# EAGLE design main_pcb (EAGLE 7.5.0)
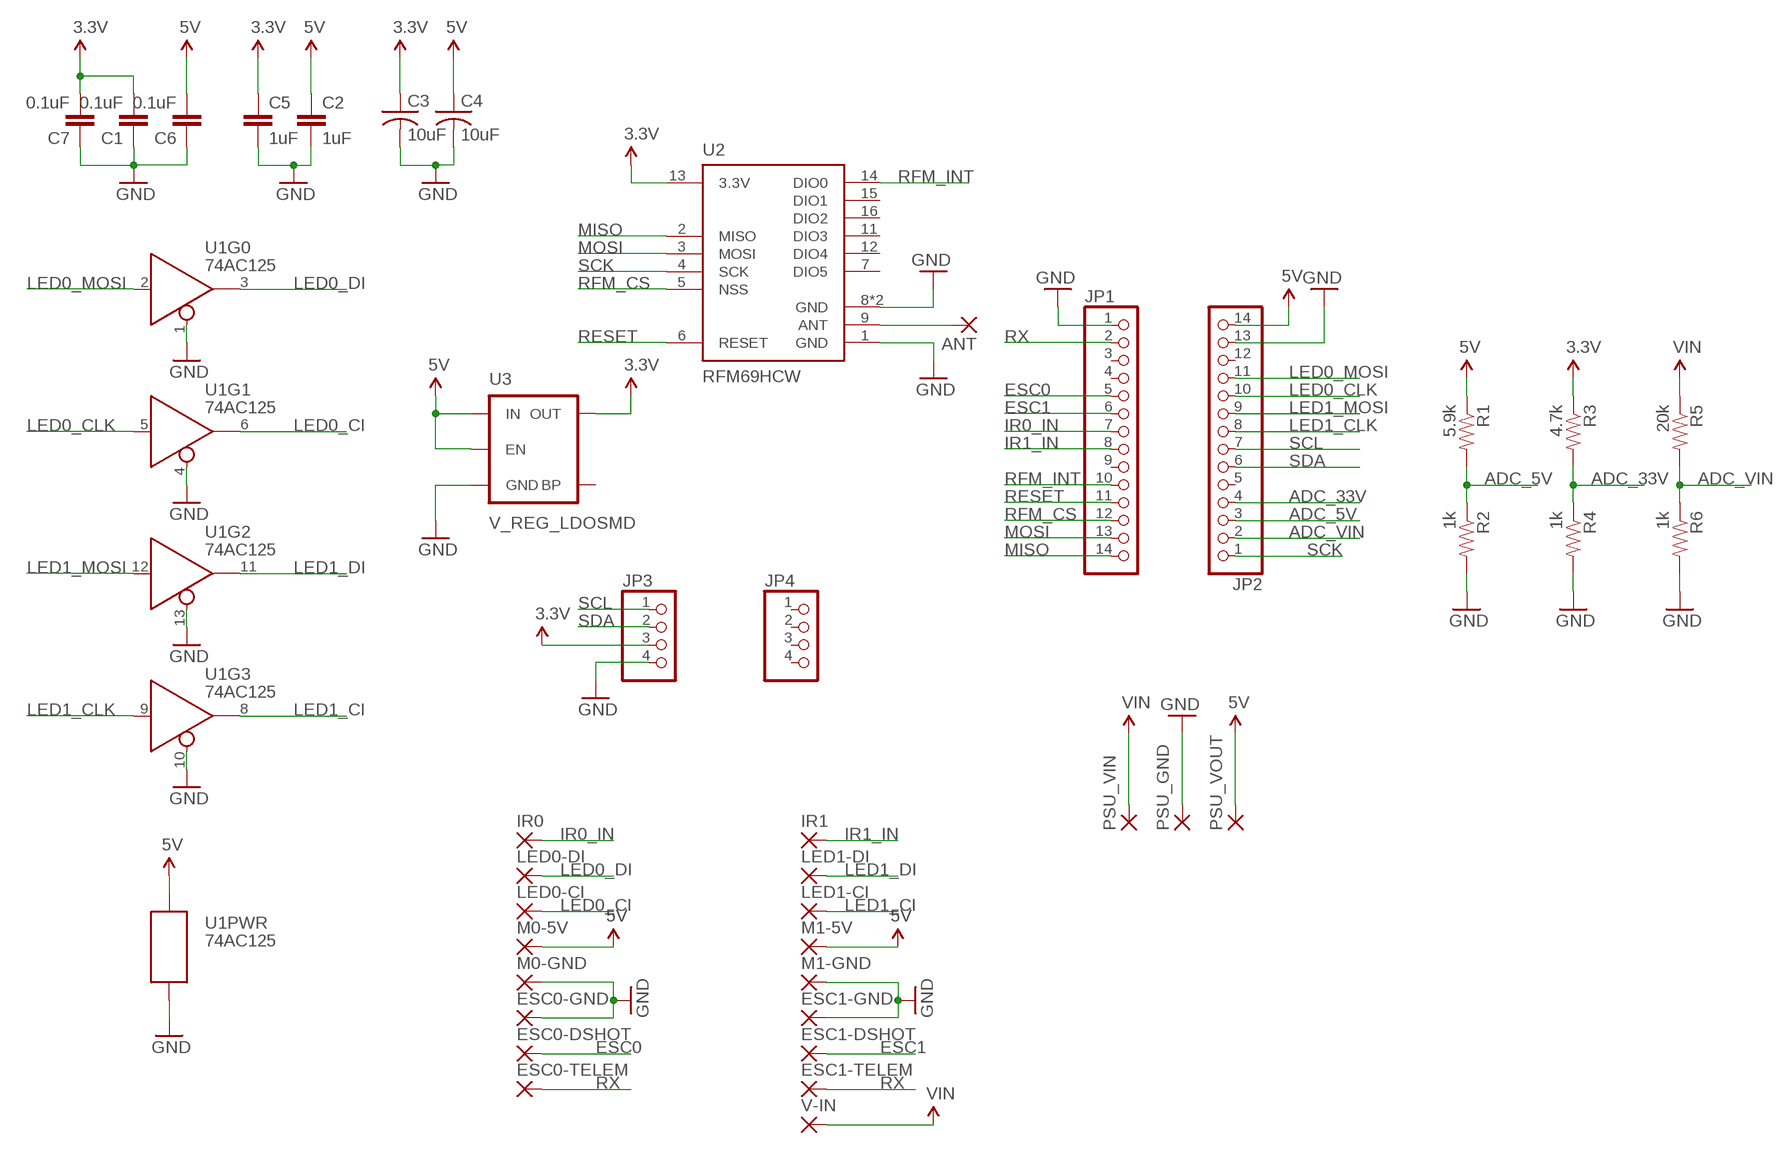
[diagram p0: schematic, sheet 1]

## Parts
ANT  WIREPADSMD5-1,8  [5-1,8]
C1  0.1uF  CAP0805  [0805]
C2  1uF  CAP0805  [0805]
C3  10uF  C-USC1206  [C1206]
C4  10uF  C-USC1206  [C1206]
C5  1uF  CAP0805  [0805]
C6  0.1uF  CAP0805  [0805]
C7  0.1uF  CAP0805  [0805]
ESC0-DSHOT  WIREPADSMD5-1,8  [5-1,8]
ESC0-GND  WIREPADSMD5-1,8  [5-1,8]
ESC0-TELEM  WIREPADSMD5-1,8  [5-1,8]
ESC1-DSHOT  WIREPADSMD5-1,8  [5-1,8]
ESC1-GND  WIREPADSMD5-1,8  [5-1,8]
ESC1-TELEM  WIREPADSMD5-1,8  [5-1,8]
IR0  WIREPADSMD5-1,8  [5-1,8]
IR1  WIREPADSMD5-1,8  [5-1,8]
JP1  PINHD-1X141X14_SMT  [1X14_SMT]
JP2  PINHD-1X141X14_SMT  [1X14_SMT]
JP3  PINHD-1X41X04_SMT  [1X04_SMT]
JP4  PINHD-1X41X04_SMT  [1X04_SMT]
LED0-CI  WIREPADSMD5-1,8  [5-1,8]
LED0-DI  WIREPADSMD5-1,8  [5-1,8]
LED1-CI  WIREPADSMD5-1,8  [5-1,8]
LED1-DI  WIREPADSMD5-1,8  [5-1,8]
M0-5V  WIREPADSMD5-1,8  [5-1,8]
M0-GND  WIREPADSMD5-1,8  [5-1,8]
M1-5V  WIREPADSMD5-1,8  [5-1,8]
M1-GND  WIREPADSMD5-1,8  [5-1,8]
PSU_GND  WIREPADSMD5-1,8  [5-1,8]
PSU_VIN  WIREPADSMD5-1,8  [5-1,8]
PSU_VOUT  WIREPADSMD5-1,8  [5-1,8]
R1  5.9k  RESISTOR0805-RES  [0805]
R2  1k  RESISTOR0805-RES  [0805]
R3  4.7k  RESISTOR0805-RES  [0805]
R4  1k  RESISTOR0805-RES  [0805]
R5  20k  RESISTOR0805-RES  [0805]
R6  1k  RESISTOR0805-RES  [0805]
U1  74AC125  74AC125DG125  [SO14]
U2  RFM69HCW  [RFM69HCW-XXXS2]
U3  V_REG_LDOSMD  [SOT23-5]
V-IN  WIREPADSMD5-1,8  [5-1,8]

## Nets
3.3V: C1.2 C3.1 C5.1 C7.2 JP3.3 R3.1 U2.13(3.3V) U3.5(OUT)
5V: C2.1 C4.1 C6.2 JP2.14 M0-5V.1(P) M1-5V.1(P) PSU_VOUT.1(P) R1.1 U1.14(PWR:P$V+) U3.1(IN) U3.3(EN)
ADC_5V: JP2.3 R1.2 R2.1
ADC_33V: JP2.4 R3.2 R4.1
ADC_VIN: JP2.2 R5.2 R6.1
ESC0: ESC0-DSHOT.1(P) JP1.5
ESC1: ESC1-DSHOT.1(P) JP1.6
GND: C1.1 C2.2 C3.2 C4.2 C5.2 C6.1 C7.1 ESC0-GND.1(P) ESC1-GND.1(P) JP1.1 JP2.13 JP3.4 M0-GND.1(P) M1-GND.1(P) PSU_GND.1(P) R2.2 R4.2 R6.2 U1.1(!EN) U1.4(!EN) U1.7(PWR:P$V-) U1.10(!EN) U1.13(!EN) U2.1(GND) U2.8(GND) U2.10(GND) U3.2(GND)
IR0_IN: IR0.1(P) JP1.7
IR1_IN: IR1.1(P) JP1.8
LED0_CI: LED0-CI.1(P) U1.6(Q)
LED0_CLK: JP2.10 U1.5(D)
LED0_DI: LED0-DI.1(P) U1.3(Q)
LED0_MOSI: JP2.11 U1.2(D)
LED1_CI: LED1-CI.1(P) U1.8(Q)
LED1_CLK: JP2.8 U1.9(D)
LED1_DI: LED1-DI.1(P) U1.11(Q)
LED1_MOSI: JP2.9 U1.12(D)
MISO: JP1.14 U2.2(MISO)
MOSI: JP1.13 U2.3(MOSI)
N$1: ANT.1(P) U2.9(ANT)
RESET: JP1.11 U2.6(RESET)
RFM_CS: JP1.12 U2.5(NSS)
RFM_INT: JP1.10 U2.14(DIO0)
RX: ESC0-TELEM.1(P) ESC1-TELEM.1(P) JP1.2
SCK: JP2.1 U2.4(SCK)
SCL: JP2.7 JP3.1
SDA: JP2.6 JP3.2
VIN: PSU_VIN.1(P) R5.1 V-IN.1(P)
Unconnected: JP1.3 JP1.4 JP1.9 JP2.5 JP2.12 JP4.1 JP4.2 JP4.3 JP4.4 U2.7(DIO5) U2.11(DIO3) U2.12(DIO4) U2.15(DIO1) U2.16(DIO2) U3.4(BP)

## Library data of the parts
ANT ESC0-DSHOT ESC0-GND ESC0-TELEM ESC1-DSHOT ESC1-GND ESC1-TELEM IR0 IR1 LED0-CI LED0-DI LED1-CI LED1-DI M0-5V M0-GND M1-5V M1-GND PSU_GND PSU_VIN PSU_VOUT V-IN = wirepad:WIREPAD: Wire PAD connect wire on PCB
C1 C2 C5-C7 = SparkFun-Capacitors:CAP: Capacitor Standard 0603 ceramic capacitor, and 0.1" leaded capacitor.
C3 C4 = adafruit:C-US: CAPACITOR, American symbol
JP1 JP2 = pinhead+:PINHD-1X14: PIN HEADER
JP3 JP4 = pinhead+:PINHD-1X4: PIN HEADER
R1-R6 = SparkFun-Resistors:RESISTOR: Resistor Basic schematic elements and footprints for 0603, 1206, and PTH resistors.
U1 = SparkFun-DigitalIC:74*125; PROD_ID: IC-08880
U2 = SparkFun-RF:RFM69H; PROD_ID: IC-11997, IC-12053
U3 = SparkFun-PowerIC:V_REG_LDO: Voltage Regulator LDO Standard 150mA LDO voltage regulator in SOT-23 layout. Micrel part MIC5205. BP (by-pass) pin is used to lower output noise with 470pF cap.

## Board
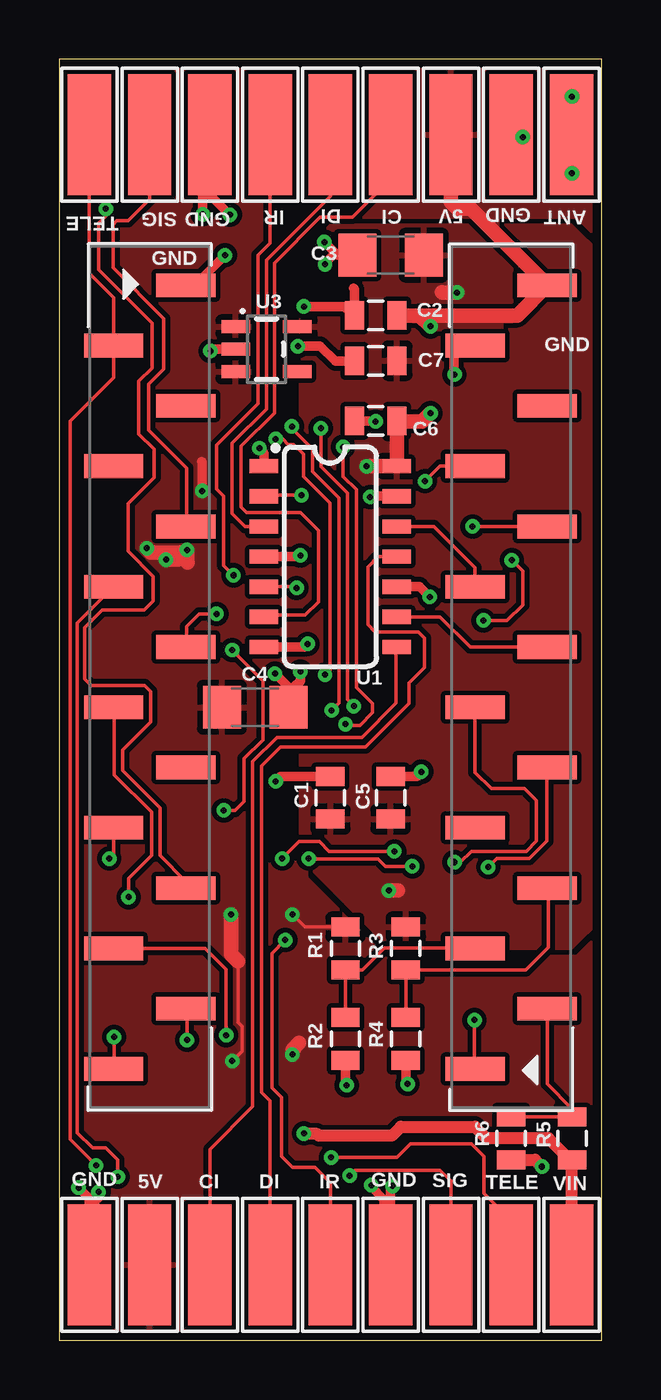
[diagram p1: board, top side]
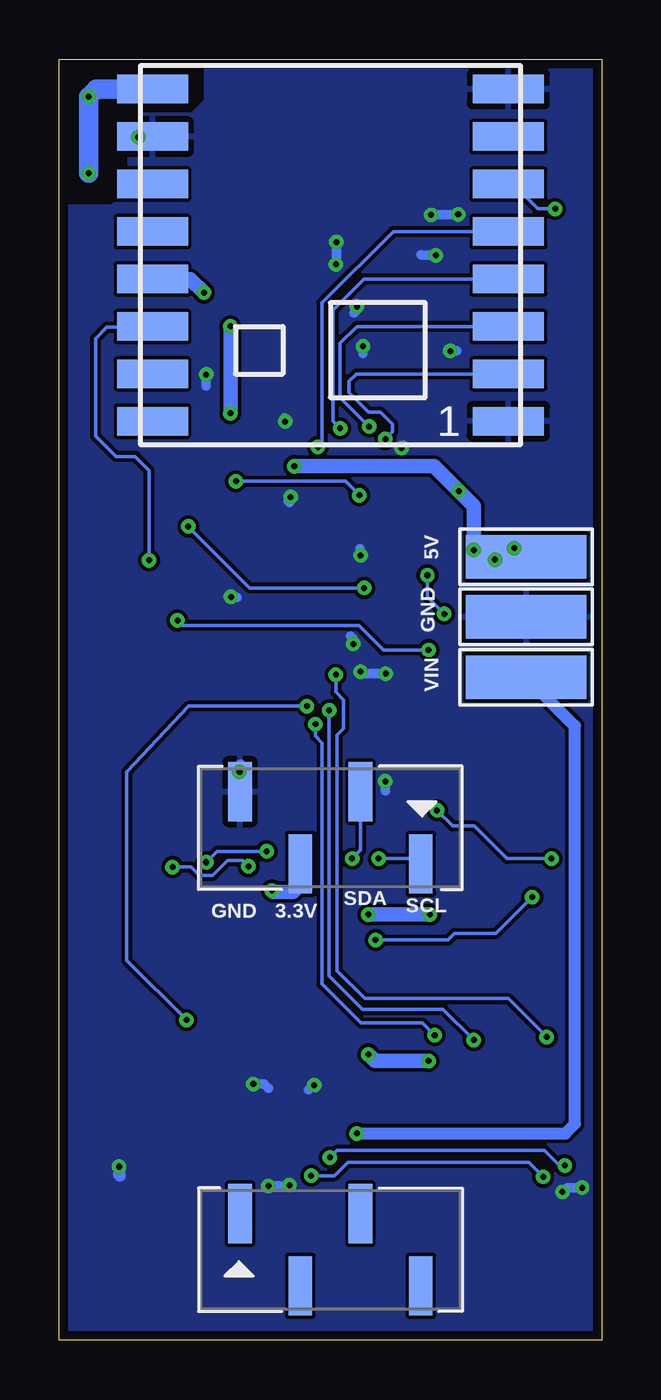
[diagram p2: board, bottom side, seen from below]

Size 22.86 x 53.98 mm. Coordinates in mm from the lower left corner, seen from the top.
Outline: 0,0 22.86,0 22.86,53.98 0,53.98 0,0
Copper layers (1*16): Top 0.0356mm / dielectric 1.5011mm / Bottom 0.0356mm
Design rules "LaenPCBOrder *": minimum track width 6mil, minimum drill 10mil, track to track 6mil, track to pad 6mil, pad to pad 6mil, via to via 6mil, smd to smd 6mil, copper to edge 15mil, drill to drill 6mil, minimum pad ring 7mil, minimum via ring 7mil, stop-mask expansion 3mil, vias tented up to drill 0mil, thermal gap 10mil
bRestrict: area 16.8,47.9 to 23.3,54.9

### Footprints (pad centres in the part's own frame; a part is rotated, then mirrored left to right if it is on the bottom)
5-1,8 = smd 1.829 x 5.08: 1 0,0
0805 = smd 0.8 x 1.2: 1 -0.9,0; 2 0.9,0
C1206 = smd 1.6 x 1.8: 1 -1.4,0; 2 1.4,0
1X14_SMT = smd 1 x 2.5: 1 -16.51,1.52; 2 -13.97,-1.52; 3 -11.43,1.52; 4 -8.89,-1.52; 5 -6.35,1.52; 6 -3.81,-1.52; 7 -1.27,1.52; 8 1.27,-1.52; 9 3.81,1.52; 10 6.35,-1.52; 11 8.89,1.52; 12 11.43,-1.52; 13 13.97,1.52; 14 16.51,-1.52
1X04_SMT = smd 1 x 2.5: 1 -3.81,1.52; 2 -1.27,-1.52; 3 1.27,1.52; 4 3.81,-1.52
SO14 = smd 0.6 x 1.2: 1 -3.81,-2.8; 2 -2.54,-2.8; 3 -1.27,-2.8; 4 0,-2.8; 5 1.27,-2.8; 6 2.54,-2.8; 7 3.81,-2.8; 8 3.81,2.8; 9 2.54,2.8; 10 1.27,2.8; 11 0,2.8; 12 -1.27,2.8; 13 -2.54,2.8; 14 -3.81,2.8
RFM69HCW-XXXS2 = smd 3 x 1.2: 1 -7.5,7; 2 -7.5,5; 3 -7.5,3; 4 -7.5,1; 5 -7.5,-1; 6 -7.5,-3; 7 -7.5,-5; 8 -7.5,-7; 9 7.5,-7; 10 7.5,-5; 11 7.5,-3; 12 7.5,-1; 13 7.5,1; 14 7.5,3; 15 7.5,5; 16 7.5,7
SOT23-5 = smd 0.55 x 1.2: 1 -0.95,-1.3; 2 0,-1.3; 3 0.95,-1.3; 4 0.95,1.3; 5 -0.95,1.3

### Placement (x,y rotation side)
ANT  21.59,50.8 0 top
C1  11.43,22.86 270 top
C2  13.34,43.18 180 top
C3  13.97,45.72 180 top
C4  8.26,26.67 0 top
C5  13.97,22.86 90 top
C6  13.34,38.73 0 top
C7  13.34,41.27 0 top
ESC0-DSHOT  3.81,50.8 0 top
ESC0-GND  6.35,50.8 0 top
ESC0-TELEM  1.27,50.8 0 top
ESC1-DSHOT  16.51,3.17 180 top
ESC1-GND  13.97,3.17 180 top
ESC1-TELEM  19.05,3.17 180 top
IR0  8.89,50.8 180 top
IR1  11.43,3.17 180 top
JP1  3.81,27.94 270 top
JP2  19.05,27.94 90 top
JP3  11.43,21.59 180 bottom
JP4  11.43,3.81 0 bottom
LED0-CI  13.97,50.8 0 top
LED0-DI  11.43,50.8 0 top
LED1-CI  6.35,3.17 180 top
LED1-DI  8.89,3.17 180 top
M0-5V  16.51,50.8 0 top
M0-GND  19.05,50.8 0 top
M1-5V  3.81,3.17 180 top
M1-GND  1.27,3.17 180 top
PSU_GND  3.17,30.48 270 bottom
PSU_VIN  3.17,27.94 270 bottom
PSU_VOUT  3.17,33.02 270 bottom
R1  12.06,16.51 270 top
R2  12.06,12.7 270 top
R3  14.61,16.51 270 top
R4  14.61,12.7 270 top
R5  21.62,8.51 90 top
R6  19.05,8.51 270 top
U1  11.43,33.02 270 top
U2  11.43,45.72 180 bottom
U3  8.74,41.76 270 top
V-IN  21.59,3.17 180 top

### Tracks (layer width: path | path; a pad name or v marks a point on that pad's centre or on a via)
3.3V  (via drill 0.25 pad 0.51)
  Top 0.61: v16.76,44.15 16.15,44.15 16.13,44.17 | v13.89,18.95 14.28,18.95
  Bottom 0.61: U2.13 17.34,44.72 v16.76,44.15 | JP3.3 12.7,19.2 13.01,18.9 13.84,18.9 v13.89,18.95
  pour Top (isolate 0.203): 10.16,21.59 10.16,20.32 13.97,16.51 21.59,16.51 22.86,17.78 22.86,45.72 21.59,46.99 11.43,46.99 10.16,45.72
5V  (via drill 0.25 pad 0.51)
  Top 0.152: R1.1 10.35,17.41 v9.83,17.93 | 7.54,15.95 7.54,13.39 7.7,13.23 7.7,12.17 v7.29,11.76
  Top 0.406: v6.02,35.79 6.02,37.01 5.99,37.03
  Top 0.61: v4.5,32.89 5,32.89 5.31,33.2 3.86,33.2 v3.68,33.38 | v5.38,33.3 5.38,32.79 5.41,32.77 | M0-5V.1 16.51,47.95 16.79,47.68 17.34,47.68 JP2.14 19.3,43.18 C2.1 15.19,43.18 v15.65,42.72 | v15.65,39.06 15.29,38.71 14.26,38.71 C6.2 U1.14 v12.95,36.83 | v7.24,17.93 7.24,16.26 7.54,15.95 | v9.83,12.04 9.83,12.24 10.11,12.52
  Bottom 0.61: PSU_VOUT.1 4.37,33.02 v4.5,32.89 | v3.68,33.38 5.31,33.38 v5.38,33.3 5.38,35.15 v6.02,35.79 7.06,36.83 v12.95,36.83 | v15.65,42.72 v15.65,39.06 | v9.83,17.93 v7.24,17.93 | v7.29,11.76 9.55,11.76 v9.83,12.04
  pour Top (isolate 0.203, rank 2): 0,0 22.86,0 22.86,54.61 0,54.61
ADC_5V
  Top 0.152: R2.1 R1.2 12.79,15.61 13.72,16.54 17.5,16.54 JP2.3
ADC_33V
  Top 0.152: R4.1 R3.2 19.67,15.61 20.62,16.56 20.62,19 JP2.4
ADC_VIN
  Top 0.152: JP2.2 20.57,10.8 21.61,9.75 R5.2 R6.1
ESC0
  Top 0.152: ESC0-DSHOT.1 3.81,48.08 2.9,47.17 2.41,47.17 2.26,47.02 2.26,45.19 4.39,43.05 4.39,40.92 3.76,40.28 3.76,38.35 5.36,36.75 5.36,34.32 JP1.5
ESC1  (via drill 0.25 pad 0.51)
  Top 0.152: ESC1-DSHOT.1 16.51,6.71 16.05,7.16 12.47,7.16 v12.24,6.93 | v2.46,6.88 2.46,7.59 1.96,8.1 1.4,8.1 0.76,8.74 0.76,30.22 JP1.6
  Bottom 0.152: v12.24,6.93 11.25,6.93 10.69,7.49 3.07,7.49 v2.46,6.88
GND  (via drill 0.25 pad 0.51)
  Top 0.406: U1.7 10.34,29.21 v10.46,29.34 | U1.4 10.11,33.02 v10.16,33.07 | U1.1 8.63,37.37 v8.43,37.59 | C6.1 13.31,38.73 v13.34,38.71 | U1.13 13.23,35.56 v13.11,35.53 | U1.10 15.19,31.75 v15.62,31.32 | C3.2 11.73,45.72 v11.18,46.28 | v11.2,45.34 11.2,45.39 11.61,45.8 11.96,45.8 11.99,45.77 | 12.39,44.32 12.44,44.28 C2.2 12.01,43.56 v10.31,43.56 | JP1.1 5.71,44.45 v6.99,45.72 | ESC0-GND.1 6.35,48.26 v7.19,47.42 | v6.04,47.45 6.04,48.51 6.07,48.54 | JP2.13 16.89,41.91 16.64,41.66 16.64,40.72 v16.66,40.69 | C4.2 9.65,27.53 v9.09,28.09 | v10.16,28.17 10.16,27.79 9.88,27.51 9.88,27.05 9.96,26.98 | C1.1 9.33,23.76 v9.12,23.55 | C5.2 15.07,23.76 v15.27,23.95 | R2.2 12.06,10.79 v12.12,10.74 | R4.2 14.61,10.87 v14.68,10.79 | ESC1-GND.1 13.97,6.43 v14.05,6.5 | v13.16,6.53 13.16,6.45 13.69,5.92 13.69,5.56 | M1-GND.1 1.27,5.97 v0.81,6.43 | v1.65,6.25 1.65,6.02 1.5,5.87 1.5,5.38 | M0-GND.1 19.43,50.8 v19.53,50.7 | U3.2 6.48,41.76 v6.38,41.68 | v10.06,41.88 11,41.88 11.63,41.25 12.41,41.25 C7.1
  Top 0.508: R6.2 20.05,7.61 v20.34,7.32
  Bottom 0.406: v10.46,29.34 10.46,29.54 10.59,29.67 | v10.16,33.07 10.16,33.33 10.19,33.35 | v8.43,37.59 8.36,37.72 | v13.34,38.71 13.34,38.86 13.36,38.89 | v13.11,35.53 13.21,35.36 13.16,35.31 | v15.62,31.32 15.39,31.32 15.37,31.29 | v11.18,46.28 11.18,45.36 v11.2,45.34 | v10.31,43.56 10.44,43.28 10.36,43.36 | v10.06,41.88 10.06,41.58 | v6.99,45.72 7.59,45.72 7.62,45.74 | v7.19,47.42 6.07,47.42 v6.04,47.45 | v16.66,40.69 16.66,40.21 | v9.09,28.09 10.08,28.09 v10.16,28.17 | v9.12,23.55 9.12,23.14 | v15.27,23.95 15.27,24.23 15.21,24.28 | v12.12,10.74 12.14,10.74 12.34,10.54 | v14.68,10.79 14.22,10.79 14.05,10.62 | v14.05,6.5 13.18,6.5 v13.16,6.53 | v0.81,6.43 1.47,6.43 v1.65,6.25 | v19.53,50.7 18.95,50.7 U2.10 | v6.38,41.68 6.12,41.68 6.1,41.71
  Bottom 0.508: v20.34,7.32 20.34,6.99 20.3,6.93
  pour Bottom: 0,0 22.86,0 22.86,54.61 0,54.61
IR0_IN  (via drill 0.25 pad 0.51)
  Top 0.152: IR0.1 8.89,46.23 8.38,45.72 8.38,39.47 6.63,37.72 6.63,35.87 6.93,35.56 6.93,32.64 v7.34,32.23 | JP1.7 5.36,29.24 5.36,30.07 5.89,30.61 v6.63,30.61
  Bottom 0.152: v7.34,32.23 7.34,31.32 v6.63,30.61
IR1_IN  (via drill 0.25 pad 0.51)
  Top 0.152: IR1.1 11.43,6.63 10.77,7.29 9.83,7.29 9.37,7.75 9.37,10.24 8.97,10.64 8.97,16.31 v9.53,16.87 | v2.92,18.67 2.92,19.46 3.89,20.42 3.89,22.25 2.31,23.82 2.31,26.65 JP1.8
  Bottom 0.152: v9.53,16.87 6.48,16.87 6.2,17.14 4.45,17.14 v2.92,18.67
LED0_CI
  Top 0.152: LED0-CI.1 13.97,48.92 12.37,47.32 11,47.32 9.07,45.39 9.07,39.06 7.67,37.67 7.67,35.1 7.9,34.87 10.16,34.87 10.92,34.11 10.92,31.11 10.36,30.56 8.71,30.56 U1.6
LED0_CLK  (via drill 0.25 pad 0.51)
  Top 0.152: U1.5 9.96,31.75 v10.01,31.7 | v17.42,34.29 JP2.10
  Bottom 0.152: v10.01,31.7 14.83,31.7 v17.42,34.29
LED0_DI
  Top 0.152: LED0-DI.1 11.43,48.21 8.74,45.52 8.74,39.24 7.29,37.8 7.29,34.82 7.82,34.29 U1.3 8.61,34.31
LED0_MOSI  (via drill 0.25 pad 0.51)
  Top 0.152: JP2.11 16.05,36.83 v15.42,36.2 | v10.21,35.61 8.68,35.61 U1.2
  Bottom 0.152: v15.42,36.2 10.79,36.2 v10.21,35.61
LED1_CI
  Top 0.152: LED1-CI.1 6.35,8.05 8.15,9.86 8.15,24.38 9.17,25.4 12.75,25.4 14.2,26.85 14.2,29.18 U1.8
LED1_CLK
  Top 0.152: U1.9 16.05,30.48 17.32,29.21 JP2.8
LED1_DI
  Top 0.152: LED1-DI.1 8.89,10.08 8.53,10.44 8.53,24.21 9.32,24.99 12.9,24.99 14.73,26.82 14.73,27.69 15.39,28.35 15.39,29.59 15.14,29.84 13.31,29.84 13.01,30.15 13.01,32.59 13.44,33.02 U1.11
LED1_MOSI
  Top 0.152: JP2.9 17.53,32.56 15.8,34.29 U1.12
MISO  (via drill 0.25 pad 0.51)
  Top 0.152: v9.12,37.97 9.42,37.97 9.65,37.74 9.88,37.74 10.29,37.34 10.29,36.4 11.4,35.28 11.4,28.25 v11.2,28.04 | v2.31,12.78 2.31,11.45 JP1.14
  Bottom 0.152: U2.2 10.33,40.72 10.64,40.41 10.64,39.93 9.83,39.12 9.32,39.12 8.81,38.61 8.81,38.28 v9.12,37.97 | v11.2,28.04 11.2,27.3 10.87,26.98 10.87,25.78 11.15,25.5 11.15,15.57 9.98,14.4 3.94,14.4 v2.31,12.78
MOSI  (via drill 0.25 pad 0.51)
  Top 0.152: v9.8,38.51 9.8,38.41 10.67,37.54 10.67,36.6 11.79,35.48 11.79,26.85 v11.48,26.54 | v5.38,12.65 5.38,13.91 JP1.13
  Bottom 0.152: U2.3 10.31,42.72 11.02,42.01 11.02,39.73 v9.8,38.51 | v11.48,26.54 11.48,15.34 10.08,13.95 6.68,13.95 v5.38,12.65
N$1  (via drill 0.25 pad 0.51)
  Top 0.813: ANT.1 21.59,49.2 v21.61,49.17 | v21.61,52.4 21.61,51.16 21.67,51.1
  Bottom 0.813: v21.61,49.17 v21.61,52.4 21.3,52.72 U2.9
RESET  (via drill 0.25 pad 0.51)
  Top 0.152: JP1.11 5.33,19.33 4.24,20.42 4.24,22.43 2.67,24 2.67,24.87 3.86,26.06 3.86,27.33 3.61,27.58 1.35,27.58 1.07,27.86 1.07,30.02 1.8,30.76 3.58,30.76 3.96,31.14 3.96,32.18 2.9,33.25 2.9,35.26 3.99,36.35 3.99,37.54 3.35,38.18 3.35,40.41 3.91,40.97 3.91,42.85 1.65,45.11 1.65,47.07 1.96,47.37 v1.96,47.68
  Bottom 0.152: U2.6 3.74,48.72 2.69,47.68 v1.96,47.68
RFM_CS  (via drill 0.25 pad 0.51)
  Top 0.152: v11.96,37.64 11.96,36.4 12.52,35.84 12.52,27.51 13.21,26.82 13.21,26.44 12.68,25.91 12.12,25.91 v12.06,25.96 | v7.04,12.85 7.04,15.62 6.15,16.51 JP1.12
  Bottom 0.152: U2.5 8.78,46.72 11.79,43.71 11.79,37.82 v11.96,37.64 | v12.06,25.96 12.06,25.45 11.79,25.17 11.79,15.01 10.13,13.36 7.54,13.36 v7.04,12.85
RFM_INT  (via drill 0.25 pad 0.61)
  Top 0.152: JP1.10 2.29,20.48 v2.11,20.3 | v6.93,22.33 7.42,22.33 7.8,22.71 7.8,24.51 8.59,25.3 8.59,27.79 v7.29,29.08 | v17.88,30.33 18.87,30.33 19.53,30.99 19.53,32.41 v19.07,32.87
  Bottom 0.152: v2.11,20.3 3.99,20.3 5.36,21.67 6.27,21.67 v6.93,22.33 | v7.29,29.08 9.2,29.08 10.24,30.12 17.68,30.12 v17.88,30.33 | v19.07,32.87 19.07,36.65 19.66,37.24 20.47,37.24 21.34,38.1 21.34,42.22 20.85,42.7 19.63,42.7 19.58,42.75 18.96,42.75 U2.14
RX  (via drill 0.25 pad 0.51)
  Top 0.152: ESC0-TELEM.1 1.27,44.96 2.29,43.94 JP1.2 2.29,40.57 0.46,38.73 0.46,8.46 v1.55,7.37 | v11.46,7.7 14.22,7.7 14.81,8.28 17.37,8.28 17.91,7.75 17.91,6.2 18.77,5.33 18.77,3.45 ESC1-TELEM.1
  Bottom 0.152: v1.55,7.37 1.78,7.37 2.41,8 11.15,8 v11.46,7.7
SCK  (via drill 0.25 pad 0.51)
  Top 0.152: v11.02,38.43 11.02,36.8 12.14,35.69 12.14,27 v12.42,26.72 | v17.5,13.49 17.5,11.46 JP2.1
  Bottom 0.152: U2.4 10.02,44.72 11.33,43.41 11.33,38.73 v11.02,38.43 | v12.42,26.72 17.4,26.72 20.02,23.95 20.02,16 v17.5,13.49
SCL  (via drill 0.25 pad 0.51)
  Top 0.152: JP2.7 17.53,23.92 18.21,23.24 19.61,23.24 20.12,22.73 20.12,21.03 19.68,20.6 17.37,20.6 16.92,20.14 v16.66,20.14 | v9.4,20.3 10.11,21.01 10.97,21.01 11.38,20.6 v14.12,20.6
  Bottom 0.152: v9.4,20.3 7.84,20.3 JP3.1 | v14.12,20.6 16.2,20.6 v16.66,20.14
SDA  (via drill 0.25 pad 0.51)
  Top 0.152: JP2.6 20.55,24.11 20.55,21.03 19.81,20.3 18.44,20.3 v18.09,19.94 | v14.88,19.96 13.74,19.96 13.44,20.27 10.54,20.27 v10.52,20.3
  Bottom 0.152: JP3.2 10.16,20.65 v10.52,20.3 | v18.09,19.94 17.3,19.94 16.94,19.58 16.41,19.58 15.77,20.22 15.14,20.22 v14.88,19.96
VIN  (via drill 0.25 pad 0.51)
  Top 0.508: V-IN.1 R5.1 21.52,7.61 20.62,8.51 18.01,8.51 17.53,8.99 14.4,8.99 14.02,8.61 10.95,8.61 10.87,8.69 10.34,8.69 v10.31,8.71
  Bottom 0.508: v10.31,8.71 1.52,8.71 1.12,9.12 1.12,25.88 PSU_VIN.1

### Text on the board
tPlace: SIG | GND | IR | DI | CI | 5V | GND | ANT | TELE | GND | C3 | U3 | C2 | GND | C7 | C6 | C4 | U1 | C1 | C5 | R1 | R3 | R2 | R4 | R6 | R5 | GND | 5V | CI | DI | IR | GND | SIG | TELE | VIN
bPlace: 5V | GND | VIN | SCL | SDA | 3.3V | GND